# Altium schematic sheet laser turret.SchDoc
size C
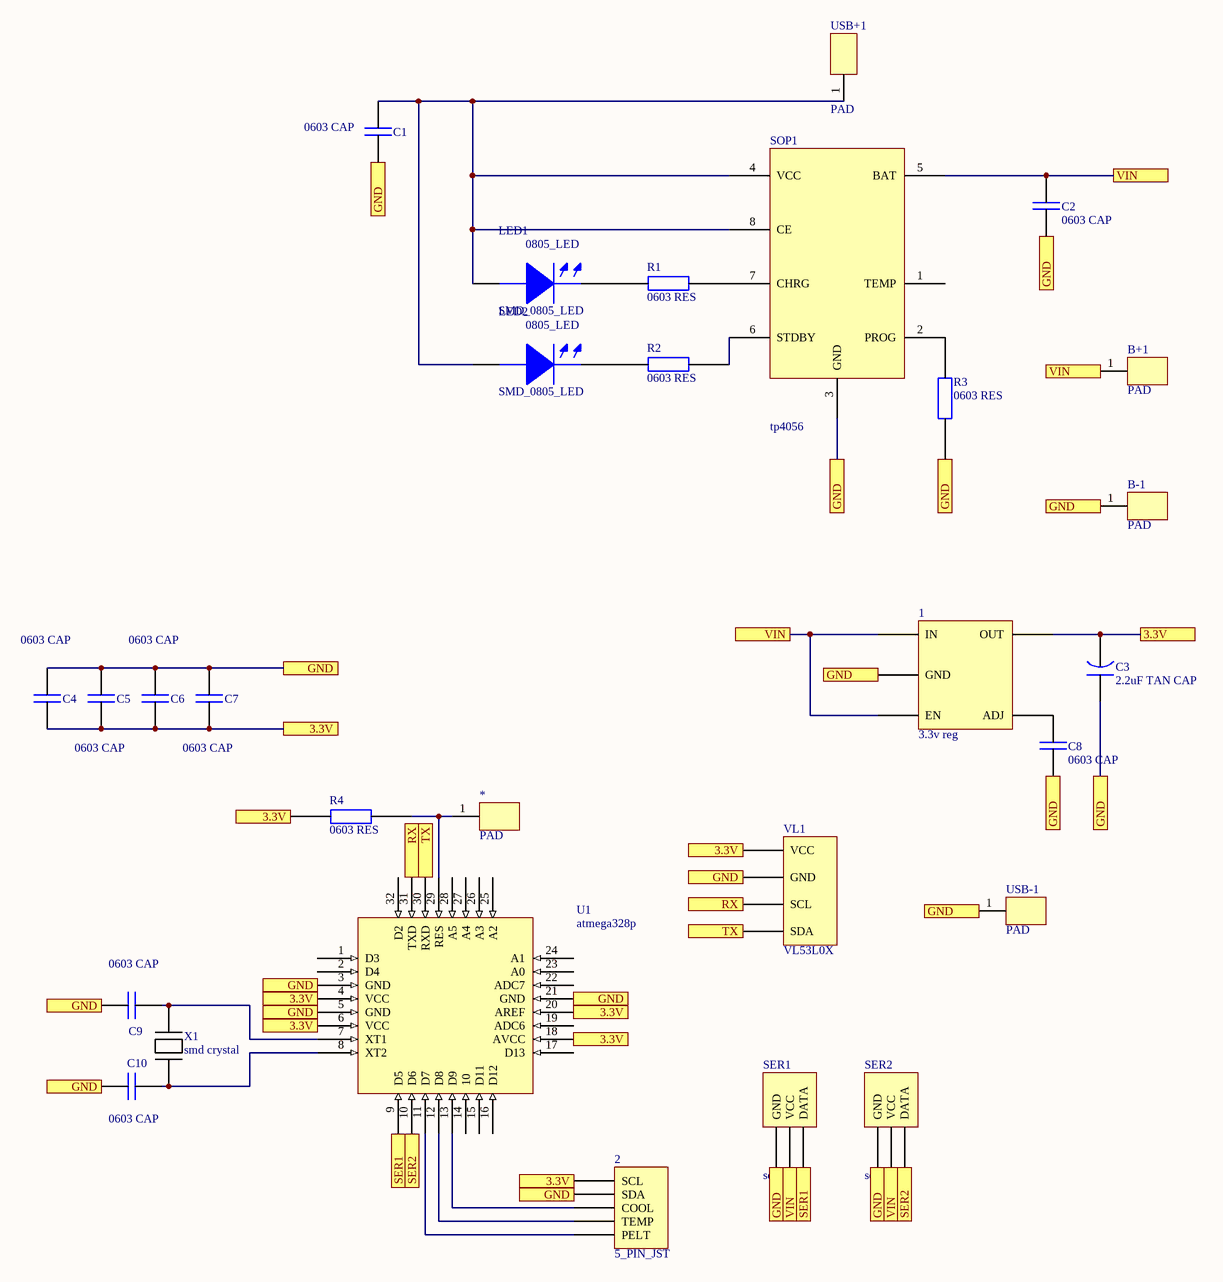
[diagram p0: laser turret.SchDoc]

## Parts
1  3.3v reg  [3.3v reg]
2  5_PIN_JST  [5_PIN_JST]
*  PAD  [PAD]
B+1  PAD  [PAD]
B-1  PAD  [PAD]
C1  0603 CAP  [0603 CAP]
C2  0603 CAP  [0603 CAP]
C3  2.2uF TAN CAP  [2.2uF TAN CAP]
C4  0603 CAP  [0603 CAP]
C5  0603 CAP  [0603 CAP]
C6  0603 CAP  [0603 CAP]
C7  0603 CAP  [0603 CAP]
C8  0603 CAP  [0603 CAP]
C9  0603 CAP  [0603 CAP]
C10  0603 CAP  [0603 CAP]
LED1  SMD_0805_LED  [0805_LED]
LED2  SMD_0805_LED  [0805_LED]
R1  0603 RES  [0603 RES]
R2  0603 RES  [0603 RES]
R3  0603 RES  [0603 RES]
R4  0603 RES  [0603 RES]
SER1  servo  [hall_jst]
SER2  servo  [hall_jst]
SOP1  tp4056  [tp4056]
U1  atmega328p  [atmega328p]
USB+1  PAD  [PAD]
USB-1  PAD  [PAD]
VL1  VL53L0X  [VL53L0x]
X1  smd crystal  [smd crystal]

## Ports
3.3V, GND, RX, SER1, SER2, TX, VIN

## Nets
3.3V: 1.5(OUT) 2.1(SCL) C3.2 C4.1 C5.1 C6.1 C7.1 R4.1 U1.4(VCC) U1.6(VCC) U1.18(AVCC) U1.20(AREF) VL1.1(VCC) ; port 3.3V
GND: 1.2(GND) 2.2(SDA) B-1.1 C1.1 C2.1 C3.1 C4.2 C5.2 C6.2 C7.2 C8.1 C9.2 C10.2 R3.1 SER1.1(GND) SER2.1(GND) SOP1.3(GND) U1.3(GND) U1.5(GND) U1.21(GND) USB-1.1 VL1.2(GND) ; port GND
RX: U1.31(TXD) VL1.3(SCL) ; port RX
SER1: SER1.3(DATA) U1.9(D5) ; port SER1
SER2: SER2.3(DATA) U1.10(D6) ; port SER2
TX: U1.30(RXD) VL1.4(SDA) ; port TX
VIN: 1.1(IN) 1.3(EN) B+1.1 C2.2 SER1.2(VCC) SER2.2(VCC) SOP1.5(BAT) ; port VIN
Net1_4: 1.4(ADJ) C8.2
Net2_3: 2.3(COOL) U1.13(D9)
Net2_4: 2.4(TEMP) U1.12(D8)
Net2_5: 2.5(PELT) U1.11(D7)
Net*_1: *.1 R4.2 U1.29(RES)
NetC1_2: C1.2 LED1.1 LED2.1 SOP1.4(VCC) SOP1.8(CE) USB+1.1
NetC9_1: C9.1 U1.7(XT1) X1.3
NetC10_1: C10.1 U1.8(XT2) X1.1
NetLED1_2: LED1.2 R1.1
NetLED2_2: LED2.2 R2.1
NetR1_2: R1.2 SOP1.7(CHRG)
NetR2_2: R2.2 SOP1.6(STDBY)
NetR3_2: R3.2 SOP1.2(PROG)

Not connected (* = marked no-connect by the designer): SOP1 1(TEMP); U1 1(D3) 2(D4) 14(10) 15(D11) 16(D12) 17(D13) 19(ADC6) 22(ADC7) 23(A0) 24(A1) 25(A2) 26(A3) 27(A4) 28(A5) 32(D2)

## Notes on the sheet
- (in symbol SMD_0805_LED) 0805_LED